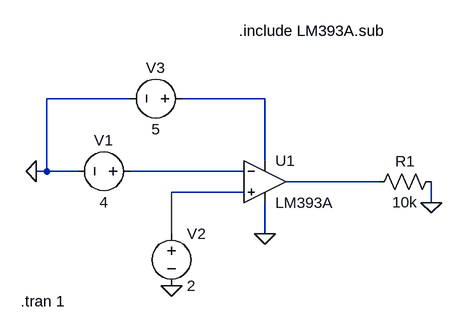
[diagram p0: schematic Analog-comparator.asc]
Analog-comparator.asc, the LTspice schematic file:
Version 4
SHEET 1 880 680
WIRE -64 48 -192 48
WIRE 144 48 16 48
WIRE 144 144 144 48
WIRE -192 160 -192 48
WIRE -192 160 -208 160
WIRE -144 160 -192 160
WIRE 112 160 -64 160
WIRE 320 176 176 176
WIRE 112 192 0 192
WIRE 400 208 400 176
WIRE 0 256 0 192
WIRE 144 256 144 208
FLAG 0 336 0
FLAG -208 160 0
FLAG 400 208 0
FLAG 144 256 0
SYMBOL voltage -48 160 R90
WINDOW 0 -32 56 VBottom 2
WINDOW 3 32 56 VTop 2
WINDOW 123 0 0 Left 0
WINDOW 39 0 0 Left 0
SYMATTR InstName V1
SYMATTR Value 4
SYMBOL voltage 0 240 R0
WINDOW 123 0 0 Left 0
WINDOW 39 0 0 Left 0
SYMATTR InstName V2
SYMATTR Value 2
SYMBOL OpAmps\\opamp2 144 112 R0
SYMATTR InstName U1
SYMATTR Value LM393A
SYMBOL res 416 160 R90
WINDOW 0 0 56 VBottom 2
WINDOW 3 32 56 VTop 2
SYMATTR InstName R1
SYMATTR Value 10k
SYMBOL voltage 32 48 R90
WINDOW 0 -32 56 VBottom 2
WINDOW 3 32 56 VTop 2
WINDOW 123 0 0 Left 0
WINDOW 39 0 0 Left 0
SYMATTR InstName V3
SYMATTR Value 5
TEXT 104 -56 Left 2 !.include LM393A.sub
TEXT -232 360 Left 2 !.tran 1

The netlist it stands for:
* Analog-comparator.asc
V1 N002 0 4
V2 N004 0 2
XU1 N004 N002 N001 0 N003 LM393A  ; pins In+ In- V+ V- OUT
R1 0 N003 10k
V3 N001 0 5
.include LM393A.sub
.tran 1
.backanno
.end